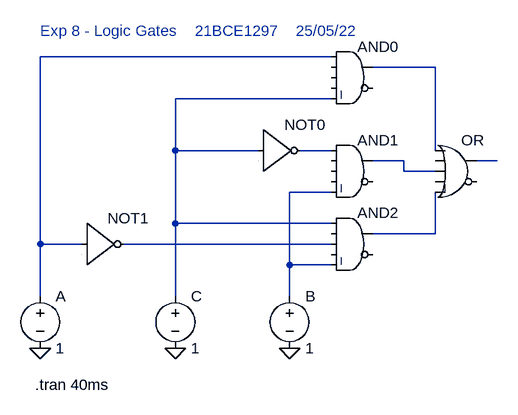
[diagram p0: schematic Expression2.asc]
Expression2.asc, the LTspice schematic file:
Version 4
SHEET 1 880 680
WIRE 432 -64 -16 -64
WIRE 592 -48 496 -48
WIRE 432 0 192 0
WIRE 192 80 192 0
WIRE 320 80 192 80
WIRE 432 80 384 80
WIRE 592 80 592 -48
WIRE 544 96 496 96
WIRE 688 96 656 96
WIRE 544 112 544 96
WIRE 592 112 544 112
WIRE 432 144 368 144
WIRE 192 192 192 80
WIRE 432 192 192 192
WIRE 592 208 592 144
WIRE 592 208 496 208
WIRE -16 224 -16 -64
WIRE 48 224 -16 224
WIRE 432 224 112 224
WIRE 368 256 368 144
WIRE 432 256 368 256
WIRE -16 304 -16 224
WIRE 192 304 192 192
WIRE 368 304 368 256
FLAG -16 384 0
FLAG 192 384 0
FLAG 368 384 0
SYMBOL voltage -16 288 R0
SYMATTR InstName A
SYMATTR Value 1
SYMBOL voltage 368 288 R0
SYMATTR InstName B
SYMATTR Value 1
SYMBOL voltage 192 288 R0
SYMATTR InstName C
SYMATTR Value 1
SYMBOL Digital\\or 624 48 R0
SYMATTR InstName OR
SYMBOL Digital\\and 464 -96 R0
SYMATTR InstName AND0
SYMBOL Digital\\and 464 48 R0
SYMATTR InstName AND1
SYMBOL Digital\\inv 320 16 R0
SYMATTR InstName NOT0
SYMBOL Digital\\and 464 160 R0
SYMATTR InstName AND2
SYMBOL Digital\\inv 48 160 R0
SYMATTR InstName NOT1
TEXT -16 -104 Left 2 ;Exp 8 - Logic Gates    21BCE1297    25/05/22
TEXT -24 440 Left 2 !.tran 40ms

The netlist it stands for:
* Expression2.asc
V§A N001 0 1
V§B N007 0 1
V§C N003 0 1
A§OR N002 0 N005 0 N008 0 N006 0 OR
AND0 N001 0 0 0 N003 0 N002 0 AND
AND1 N004 0 0 0 N007 0 N005 0 AND
A§NOT0 N003 0 0 0 0 N004 0 0 BUF
AND2 N003 0 N009 0 N007 0 N008 0 AND
A§NOT1 N001 0 0 0 0 N009 0 0 BUF
* Exp 8 - Logic Gates    21BCE1297    25/05/22
.tran 40ms
.backanno
.end